# EAGLE design brakelight_V4 (EAGLE 9.5.2)
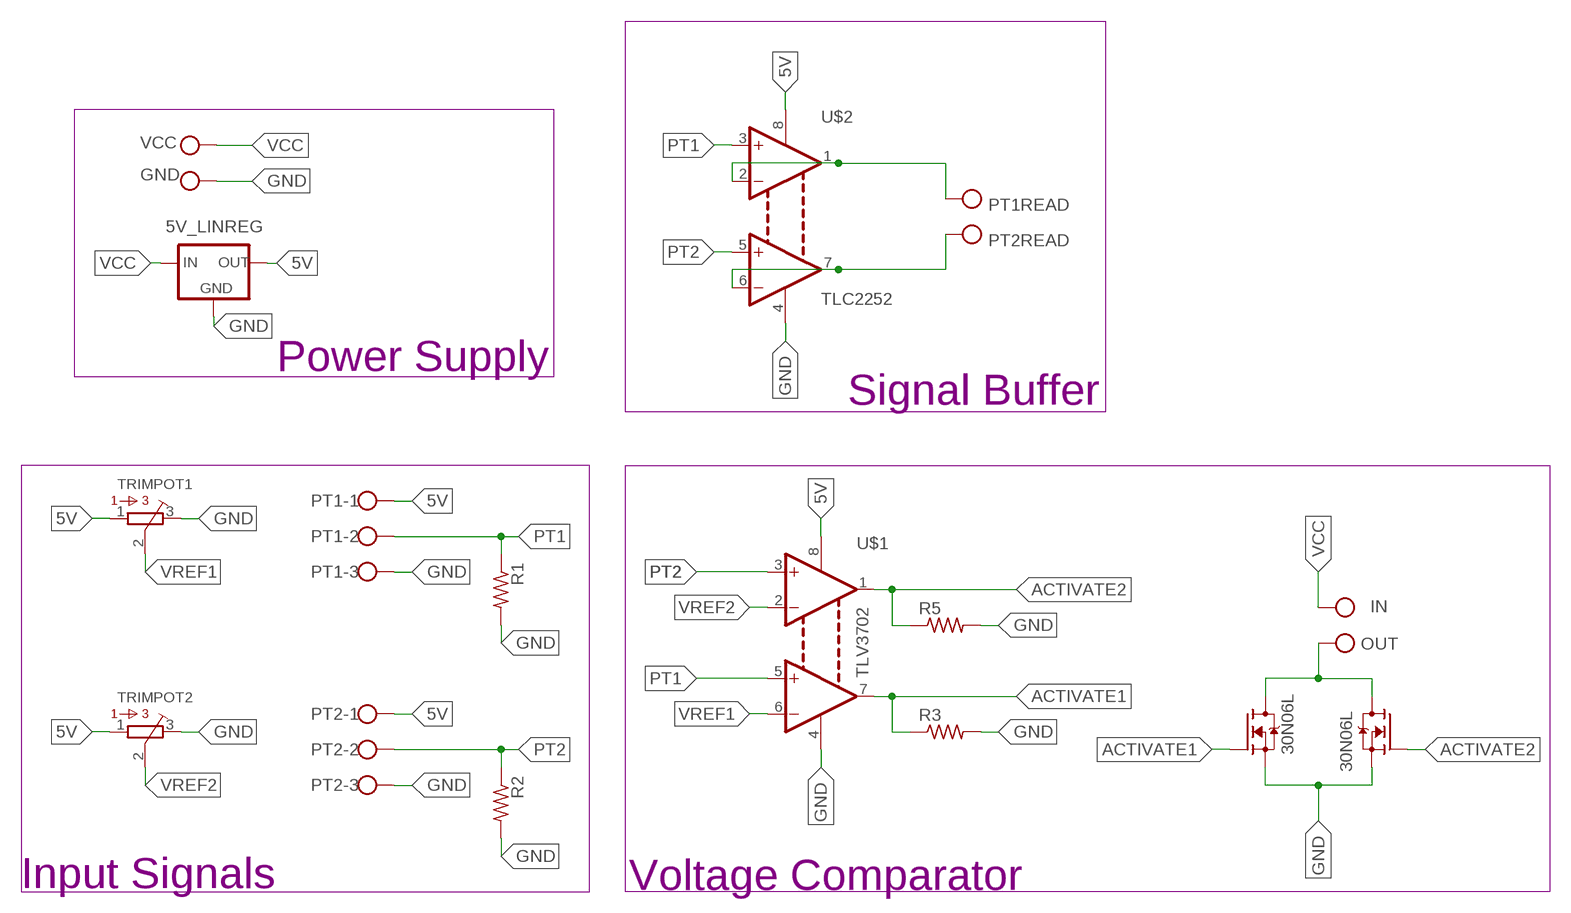
[diagram p0: schematic, sheet 1]

## Parts
5V_LINREG  78XXS  [78XXS]
BRAKELIGHT  W237-102  [W237-102]
INO_READ  W237-102  [W237-102]
LIPO_CONN  W237-102  [W237-102]
PT1  W237-103  [W237-103]
PT2  W237-103  [W237-103]
Q1  30N06L  FQP30N06L  [TO220V]
Q2  30N06L  FQP30N06L  [TO220V]
R1  R-US_0207/5V  [0207/5V]
R2  R-US_0207/5V  [0207/5V]
R3  R-US_0207/5V  [0207/5V]
R5  R-US_0207/5V  [0207/5V]
TRIMPOT1  3386-Y  [3386Y]
TRIMPOT2  3386-Y  [3386Y]
U$1  TLV3702  [DIL08]
U$2  TLC2252  [DIL08]

## Nets
5V: 5V_LINREG.OUT PT1.1 PT2.1 TRIMPOT1.1 TRIMPOT2.1 U$1.8(V+) U$2.8(V+)
ACTIVATE1: Q2.1(G) R3.1 U$1.7(2OUT)
ACTIVATE2: Q1.1(G) R5.1 U$1.1(1OUT)
GND: 5V_LINREG.GND LIPO_CONN.2 PT1.3 PT2.3 Q1.3(S) Q2.3(S) R1.2 R2.2 R3.2 R5.2 TRIMPOT1.3 TRIMPOT2.3 U$1.4(V-) U$2.4(V-)
N$2: BRAKELIGHT.2 Q1.2(D) Q2.2(D)
N$6: INO_READ.1 U$2.1(1OUT) U$2.2(1IN-)
N$7: INO_READ.2 U$2.6(2IN-) U$2.7(2OUT)
PT1: PT1.2 R1.1 U$1.5(2IN+) U$2.3(1IN+)
PT2: PT2.2 R2.1 U$1.3(1IN+) U$2.5(2IN+)
VCC: 5V_LINREG.IN BRAKELIGHT.1 LIPO_CONN.1
VREF1: TRIMPOT1.2 U$1.6(2IN-)
VREF2: TRIMPOT2.2 U$1.2(1IN-)

## Notes on the sheet
- Power Supply
- Signal Buffer
- Input Signals | Voltage Comparator

## Library data of the parts
5V_LINREG = v-reg:78XXS: VOLTAGE REGULATOR
BRAKELIGHT INO_READ LIPO_CONN = con-wago-500:W237-102: WAGO SCREW CLAMP; MPN: 237-102; OC_FARNELL: unknown; OC_NEWARK: 70K9898
PT1 PT2 = con-wago-500:W237-103: WAGO SCREW CLAMP; MPN: 237-103; OC_FARNELL: unknown; OC_NEWARK: 18M7116
Q1 Q2 = FQP30N06L:FQP30N06L: N-Channel QFET® MOSFET Source: Data Sheet; AVAILABILITY: Unavailable; DESCRIPTION: N-Channel 60V 32A _Tc_ 79W _Tc_ Through Hole TO-220-3; MF: ON Semiconductor; MP: FQP30N06L; PACKAGE: TO-220 ON Semiconductor; PRICE: None; SPICEPREFIX: Q
R1-R3 R5 = 0ohmresistor:R-US_: RESISTOR, American symbol; SPICEPREFIX: R
TRIMPOT1 TRIMPOT2 = bourns:3386-: 3386 Series 3/8" Square Trimmer Potentiometer
U$1 = GTOR:TLV3702: Comparator General Purpose CMOS, Push-Pull, Rail-to-Rail 8-PDIP
U$2 = GTOR:TLC2252: General Purpose Operational Amplifier Dual Circuit Rail-to-Rail 8-PDIP

## Board
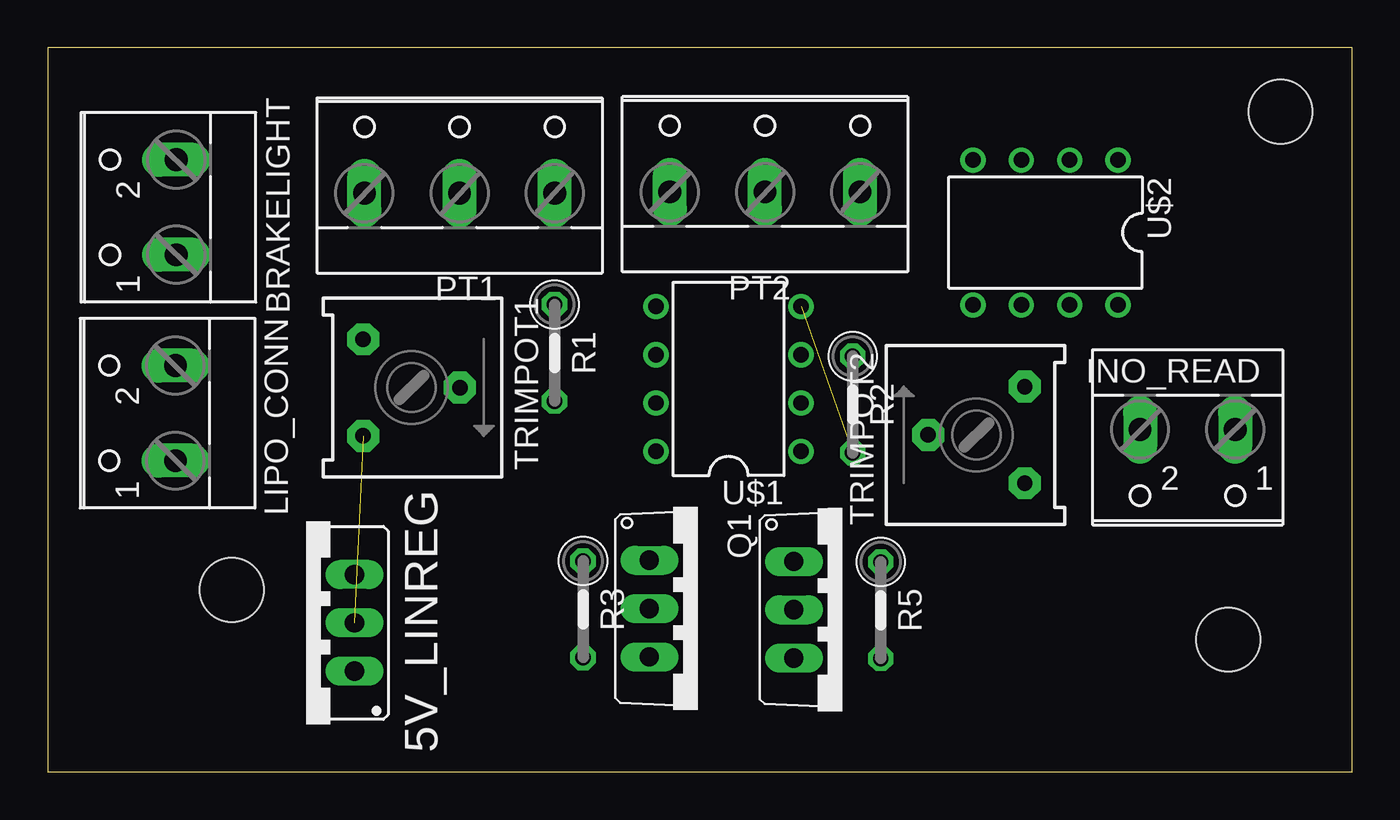
[diagram p1: board, top side]
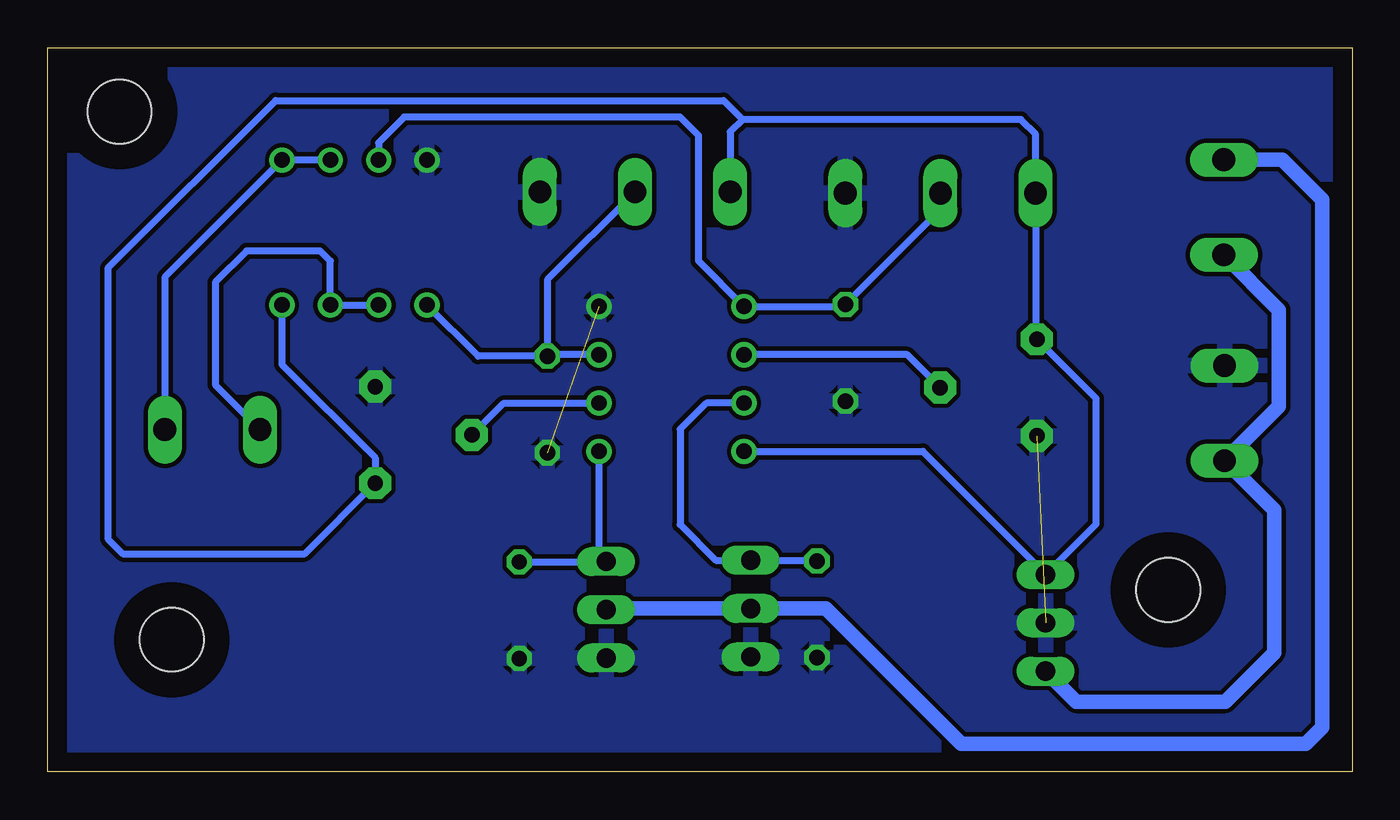
[diagram p2: board, bottom side, seen from below]

Size 68.58 x 38.1 mm. Coordinates in mm from the lower left corner, seen from the top.
Outline: 0,0 68.58,0 68.58,38.1 0,38.1 0,0
Copper layers (1*16): Top 0.035mm / dielectric 1.5mm / Bottom 0.035mm
Design rules "default": minimum track width 6mil, minimum drill 0.35mm, track to track 6mil, track to pad 6mil, pad to pad 6mil, via to via 6mil, smd to smd 6mil, copper to edge 40mil, drill to drill 6mil, minimum pad ring 10mil, minimum via ring 8mil, stop-mask expansion 4mil, vias tented up to drill 0mil, thermal gap 10mil

### Footprints (pad centres in the part's own frame; a part is rotated, then mirrored left to right if it is on the bottom)
78XXS = drill 1.016 long: GND 0,-2.54; IN -2.54,-2.54; OUT 2.54,-2.54
W237-102 = drill 1.194 long: 1 -2.5,-1.27; 2 2.5,-1.27
W237-103 = drill 1.194 long: 1 -5,-1.29; 2 0,-1.29; 3 5,-1.29
TO220V = drill 1.016 long: 1 -2.54,-2.54; 2 0,-2.54; 3 2.54,-2.54
0207/5V = drill 0.813 octagon: 1 -2.54,0; 2 2.54,0
3386Y = drill 0.813 pad 1.676 octagon: 1 -2.54,-2.54; 2 0,2.54; 3 2.54,-2.54
DIL08 = drill 0.813 pad 1.27: 1 -3.81,-3.81; 2 -1.27,-3.81; 3 1.27,-3.81; 4 3.81,-3.81; 5 3.81,3.81; 6 1.27,3.81; 7 -1.27,3.81; 8 -3.81,3.81
SOLE_HOLE = hole 3.353: 0,0

### Placement (x,y rotation side)
5V_LINREG  13.59,7.84 90 top
BRAKELIGHT  5.49,29.7 90 top
INO_READ  59.92,16.74 180 top
LIPO_CONN  5.45,18.87 90 top
PT1  21.65,31.73 0 top
PT2  37.7,31.8 0 top
Q1  41.76,8.53 270 top
Q2  34.16,8.59 270 top
R1  26.64,22.05 270 top
R2  42.32,19.33 270 top
R3  28.14,8.56 270 top
R5  43.79,8.51 270 top
TRIMPOT1  19.13,20.22 270 top
TRIMPOT2  48.82,17.73 90 top
U$1  35.79,20.68 90 top
U$2  52.45,28.37 180 top
U$3  [SOLE_HOLE]  64.8,34.72 0 top
U$4  [SOLE_HOLE]  62.05,6.96 0 top
U$5  [SOLE_HOLE]  9.68,9.58 0 top

### Tracks (layer width: path | path; a pad name or v marks a point on that pad's centre or on a via)
5V
  Bottom 0.381: 32.05,34.31 17.43,34.31 16.65,33.54 PT1.1 16.65,22.82 TRIMPOT1.1 13.49,19.66 13.49,13.02 16.11,10.4 | PT2.1 32.7,33.67 32.05,34.31 | 16.11,10.4 5V_LINREG.OUT | U$2.8 56.26,21.44 51.36,16.54 TRIMPOT2.1 55.07,11.48 64.62,11.48 65.41,12.27 65.41,26.49 56.59,35.31 33.05,35.31 32.05,34.31 | U$1.8 22.58,16.87 16.11,10.4
ACTIVATE1
  Bottom 0.381: R3.1 31.59,11.1 Q2.1 33.45,11.13 35.33,13.01 35.33,18.03 33.96,19.41 U$1.7
ACTIVATE2
  Bottom 0.381: U$1.1 39.6,11.46 Q1.1 39.24,11.05 R5.1
GND  (2 unrouted)
  pour Bottom (isolate 0.229): 0,38.28 68.61,38.28 68.61,-0.43 0,-0.43
N$2
  Bottom 0.762: BRAKELIGHT.2 3.68,32.2 1.57,30.1 1.57,2.36 2.46,1.47 20.55,1.47 27.67,8.6 Q2.2 39.16,8.6 Q1.2
N$6
  Bottom 0.381: U$2.2 U$2.1 62.42,26.02 INO_READ.1
N$7
  Bottom 0.381: U$2.6 U$2.7 53.72,26.87 54.25,27.41 58.12,27.41 59.77,25.76 59.77,20.36 INO_READ.2
PT1
  Bottom 0.381: PT1.2 21.65,29.58 R1.1 26.75,24.49 U$1.5 34.37,26.87 34.37,33.48 35.33,34.44 49.84,34.44 51.18,33.1 U$2.3
PT2
  Bottom 0.381: U$1.3 42.24,21.95 R2.1 | R2.1 45.95,21.87 U$2.5 | PT2.2 42.32,25.89 R2.1
VCC
  Bottom 0.762: BRAKELIGHT.1 3.86,24.3 3.86,19.23 LIPO_CONN.1 4.12,13.77 4.12,6.27 6.68,3.71 14.53,3.71 5V_LINREG.IN
VREF1
  Bottom 0.381: TRIMPOT1.2 23.39,21.95 U$1.6
VREF2
  Bottom 0.381: TRIMPOT2.2 44.6,19.41 U$1.2